# EAGLE design central (EAGLE 9.5.1)
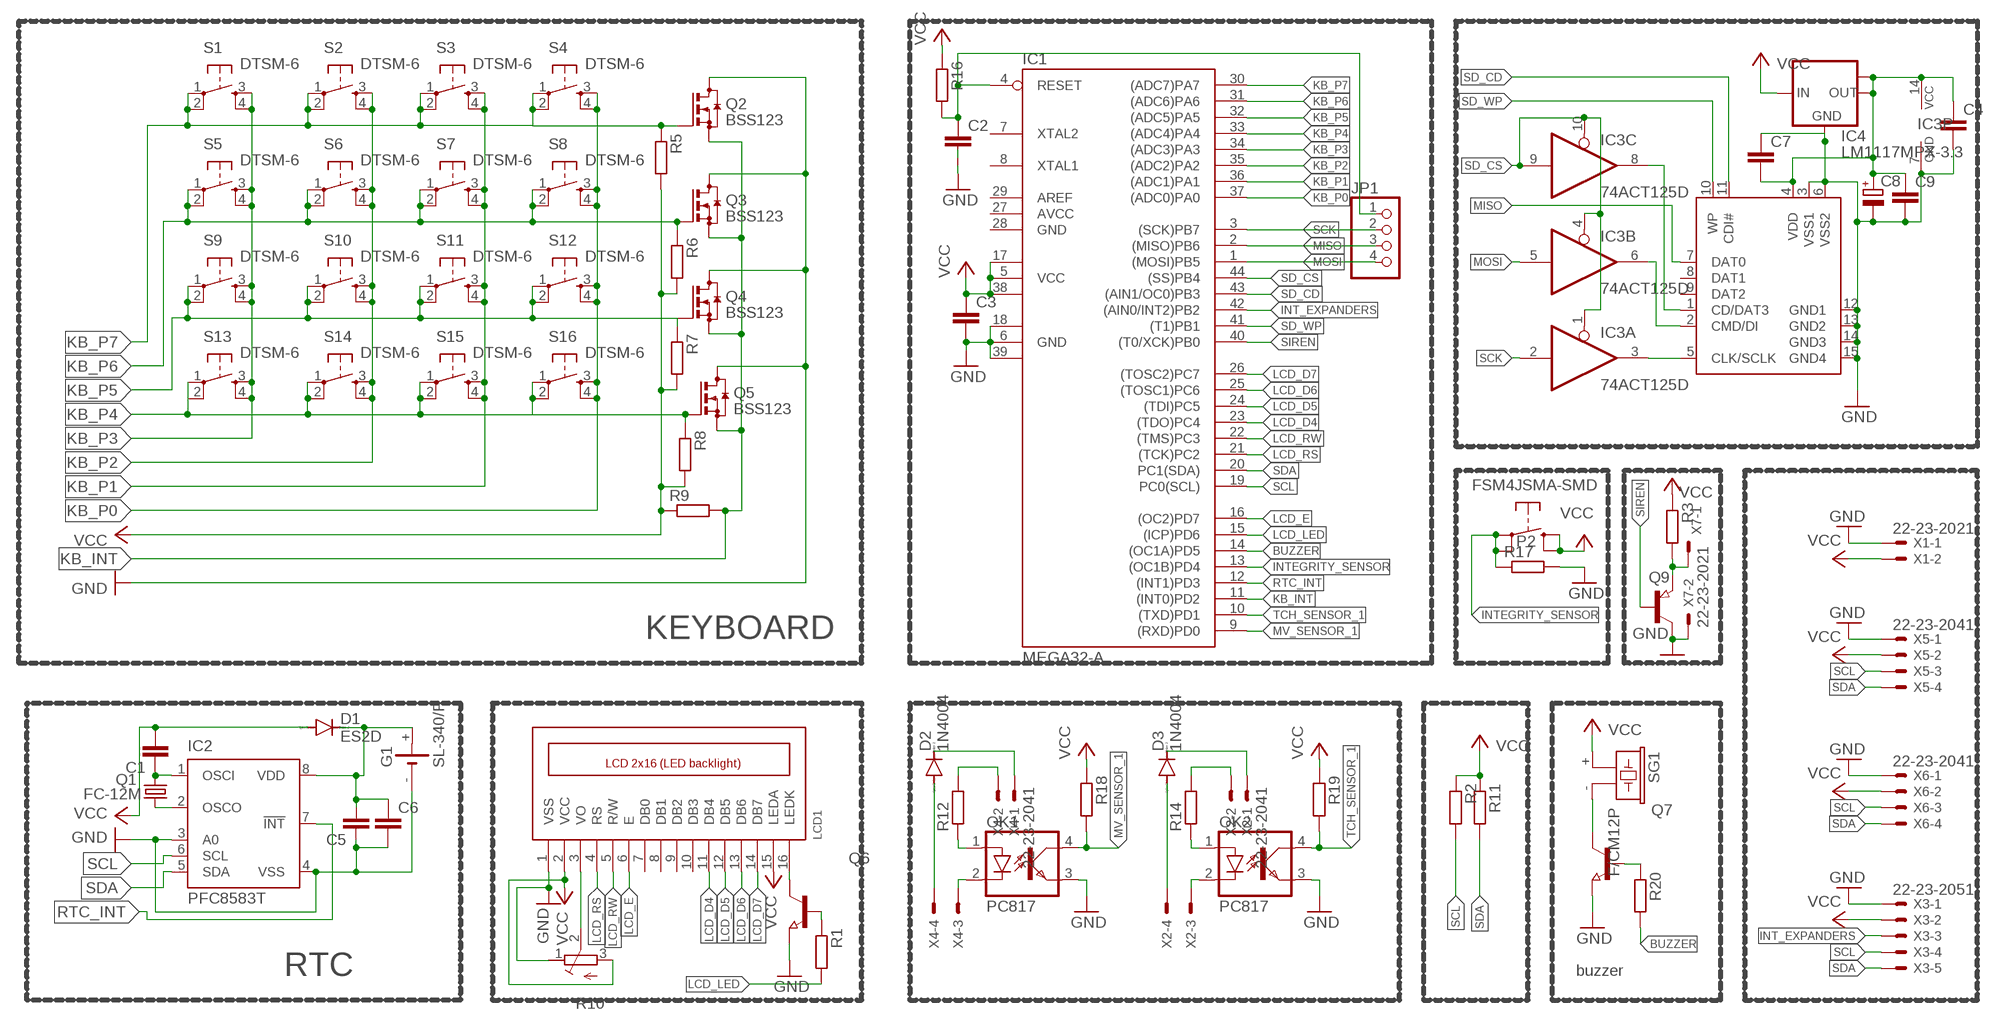
[diagram p0: schematic, sheet 1]

## Parts
C1  C-EUC2012  [C2012]
C2  C-EUC2012  [C2012]
C3  C-EUC2012  [C2012]
C4  C-EUC4532  [C4532]
C5  C-EUC2012  [C2012]
C6  C-EUC4532  [C4532]
C7  C-EUC4532  [C4532]
C8  CPOL-EUE1.8-4  [E1,8-4]
C9  C-EUC4532  [C4532]
D1  ES2D  [SMB]
D2  1N4004  [DO41-10]
D3  1N4004  [DO41-10]
G1  SL-340/P  [BEL/P]
IC1  MEGA32-A  [TQFP44]
IC2  PFC8583T  [SO8-7_5]
IC3  74ACT125D  [SO14]
IC4  LM1117MPX-3.3  [SOT223]
JP1  PINHD-1X4/90  [1X04/90]
LCD1  LCD_2X16_SIL  [HY-1602F]
OK1  PC817  [DIL04]
OK2  PC817  [DIL04]
P2  FSM4JSMA-SMD  [FSM4JSMA-SMD]
Q1  FC-12M  [FC-12M]
Q2  BSS123  [SOT23]
Q3  BSS123  [SOT23]
Q4  BSS123  [SOT23]
Q5  BSS123  [SOT23]
Q6  NPN-TRANSISTOR_SOT23  [SOT23]
Q7  NPN-TRANSISTOR_SOT23  [SOT23]
Q9  PNP-TRANSISTOR_SOT23  [SOT23]
R1  R-EU_M3216  [M3216]
R2  R-EU_M3216  [M3216]
R3  R-EU_M3216  [M3216]
R5  R-EU_M3216  [M3216]
R6  R-EU_M3216  [M3216]
R7  R-EU_M3216  [M3216]
R8  R-EU_M3216  [M3216]
R9  R-EU_M3216  [M3216]
R10  R-TRIMM3314G  [RTRIM3314G]
R11  R-EU_M3216  [M3216]
R12  R-EU_0309/12  [0309/12]
R14  R-EU_0309/12  [0309/12]
R16  R-EU_M3216  [M3216]
R17  R-EU_M3216  [M3216]
R18  R-EU_M3216  [M3216]
R19  R-EU_M3216  [M3216]
R20  R-EU_M3216  [M3216]
S1  DTSM-6  [DTSM-6]
S2  DTSM-6  [DTSM-6]
S3  DTSM-6  [DTSM-6]
S4  DTSM-6  [DTSM-6]
S5  DTSM-6  [DTSM-6]
S6  DTSM-6  [DTSM-6]
S7  DTSM-6  [DTSM-6]
S8  DTSM-6  [DTSM-6]
S9  DTSM-6  [DTSM-6]
S10  DTSM-6  [DTSM-6]
S11  DTSM-6  [DTSM-6]
S12  DTSM-6  [DTSM-6]
S13  DTSM-6  [DTSM-6]
S14  DTSM-6  [DTSM-6]
S15  DTSM-6  [DTSM-6]
S16  DTSM-6  [DTSM-6]
SG1  F/CM12P  [F/CM12P]
U$1  SDCARDVAR1  [SDCMF-10915W010]
X1  22-23-2021  [22-23-2021]
X2  22-23-2041  [22-23-2041]
X3  22-23-2051  [22-23-2051]
X4  22-23-2041  [22-23-2041]
X5  22-23-2041  [22-23-2041]
X6  22-23-2041  [22-23-2041]
X7  22-23-2021  [22-23-2021]

## Nets
BUZZER: IC1.14((OC1A)PD5) R20.2
GND [New Class]: C2.2 C3.2 C4.2 C5.1 C6.2 C7.1 C8.- C9.2 G1.- IC1.6(GND) IC1.18(GND1) IC1.39(GND2) IC2.3(A0) IC2.4(VSS) IC3.7(P:GND) IC4.1(GND) LCD1.1(VSS) OK1.3(EMIT) OK2.3(EMIT) Q2.3(D) Q3.3(D) Q4.3(D) Q5.3(D) Q6.2(E) Q7.2(E) Q9.3(C) R10.1(E) R17.2 U$1.3(VSS1) U$1.6(VSS2) U$1.12(GND1) U$1.13(GND2) U$1.14(GND3) U$1.15(GND4) X1.1 X3.1 X5.1 X6.1 X7.2
INT_EXPANDERS: IC1.42((AIN0/INT2)PB2) X3.3
INTEGRITY_SENSOR [New Class]: IC1.13((OC1B)PD4) P2.P$1(P) P2.P$2(P) R17.1
KB_INT [New Class]: IC1.11((INT0)PD2) Q2.2(S) Q3.2(S) Q4.2(S) Q5.2(S) R9.2
KB_P0 [New Class]: IC1.37((ADC0)PA0) S4.3 S4.4 S8.3 S8.4 S12.3 S12.4 S16.3 S16.4
KB_P1 [New Class]: IC1.36((ADC1)PA1) S3.3 S3.4 S7.3 S7.4 S11.3 S11.4 S15.3 S15.4
KB_P2 [New Class]: IC1.35((ADC2)PA2) S2.3 S2.4 S6.3 S6.4 S10.3 S10.4 S14.3 S14.4
KB_P3 [New Class]: IC1.34((ADC3)PA3) S1.3 S1.4 S5.3 S5.4 S9.3 S9.4 S13.3 S13.4
KB_P4 [New Class]: IC1.33((ADC4)PA4) Q5.1(G) R8.1 S13.1 S13.2 S14.1 S14.2 S15.1 S15.2 S16.1 S16.2
KB_P5 [New Class]: IC1.32((ADC5)PA5) Q4.1(G) R7.1 S9.1 S9.2 S10.1 S10.2 S11.1 S11.2 S12.1 S12.2
KB_P6 [New Class]: IC1.31((ADC6)PA6) Q3.1(G) R6.1 S5.1 S5.2 S6.1 S6.2 S7.1 S7.2 S8.1 S8.2
KB_P7 [New Class]: IC1.30((ADC7)PA7) Q2.1(G) R5.1 S1.1 S1.2 S2.1 S2.2 S3.1 S3.2 S4.1 S4.2
LCD_D4 [New Class]: IC1.23((TDO)PC4) LCD1.11(DB4)
LCD_D5 [New Class]: IC1.24((TDI)PC5) LCD1.12(DB5)
LCD_D6 [New Class]: IC1.25((TOSC1)PC6) LCD1.13(DB6)
LCD_D7 [New Class]: IC1.26((TOSC2)PC7) LCD1.14(DB7)
LCD_E [New Class]: IC1.16((OC2)PD7) LCD1.6(E)
LCD_LED [New Class]: IC1.15((ICP)PD6) R1.2
LCD_RS [New Class]: IC1.21((TCK)PC2) LCD1.4(RS)
LCD_RW [New Class]: IC1.22((TMS)PC3) LCD1.5(R/W)
MISO: IC1.2((MISO)PB6) JP1.3 U$1.7(DAT0)
MOSI: IC1.1((MOSI)PB5) IC3.5(B:I) JP1.4
MV_SENSOR_1: IC1.9((RXD)PD0) OK1.4(COL) R18.2
N$1: C1.1 IC2.1(OSCI) Q1.2
N$2: IC2.2(OSCO) Q1.1
N$3: D2.A X4.4
N$4: D3.A X2.4
N$5: C5.2 C6.1 D1.C G1.+ IC2.8(VDD)
N$6: LCD1.16(LEDK) Q6.3(C)
N$7: OK1.2(C) X4.3
N$8: R12.2 X4.2
N$9: D2.C X4.1
N$10: OK2.2(C) X2.3
N$11: R14.2 X2.2
N$12: D3.C X2.1
N$13: Q7.3(C) SG1.-
N$14: LCD1.3(VO) R10.2(S)
N$15: Q7.1(B) R20.1
N$16: C2.1 IC1.4(RESET) JP1.1 R16.2
N$17: Q6.1(B) R1.1
N$18: IC3.3(A:O) U$1.5(CLK/SCLK)
N$19: OK2.1(A) R14.1
N$20: IC3.6(B:O) U$1.2(CMD/DI)
N$21: OK1.1(A) R12.1
N$22: Q9.2(E) R3.2 X7.1
N$23: IC3.8(C:O) U$1.1(CD/DAT3)
N$28: C4.1 C7.2 C8.+ C9.1 IC3.14(P:VCC) IC4.2(OUT) IC4.TAB(OUT1) U$1.4(VDD)
RTC_INT [New Class]: IC1.12((INT1)PD3) IC2.7(!INT)
SCK: IC1.3((SCK)PB7) IC3.2(A:I) JP1.2
SCL [New Class]: IC1.19(PC0(SCL)) IC2.6(SCL) R2.2 X3.4 X5.3 X6.3
SD_CD: IC1.43((AIN1/OC0)PB3) U$1.11(CDI#)
SD_CS: IC1.44((SS)PB4) IC3.1(A:OE) IC3.4(B:OE) IC3.9(C:I) IC3.10(C:OE)
SD_WP: IC1.41((T1)PB1) U$1.10(WP)
SDA [New Class]: IC1.20(PC1(SDA)) IC2.5(SDA) R11.2 X3.5 X5.4 X6.4
SIREN [New Class]: IC1.40((T0/XCK)PB0) Q9.1(B)
TCH_SENSOR_1: IC1.10((TXD)PD1) OK2.4(COL) R19.2
VCC [New Class]: C1.2 C3.1 D1.A IC1.5(VCC) IC1.17(VCC1) IC1.38(VCC2) IC4.3(IN) LCD1.2(VCC) LCD1.15(LEDA) P2.P$3(S) P2.P$4(S) R2.1 R3.1 R5.2 R6.2 R7.2 R8.2 R9.1 R10.3(A) R11.1 R16.1 R18.1 R19.1 SG1.+ X1.2 X3.2 X5.2 X6.2
Unconnected: IC1.7(XTAL2) IC1.8(XTAL1) IC1.29(AREF) IC3.11(D:O) IC3.12(D:I) IC3.13(D:OE) LCD1.7(DB0) LCD1.8(DB1) LCD1.9(DB2) LCD1.10(DB3) U$1.8(DAT1) U$1.9(DAT2)

## Notes on the sheet
- KEYBOARD
- RTC | buzzer

## Power pins joined to a net without a drawn wire
AVCC: IC1.27(AVCC)
GND: IC1.28(GND)

## Library data of the parts
C1-C7 C9 = rcl:C-EU: CAPACITOR, European symbol; SPICEPREFIX: C
C8 = rcl:CPOL-EU: POLARIZED CAPACITOR, European symbol; SPICEPREFIX: C
D1 = diode:ES2D: DIODE super fast rectifier, 2 A
D2 D3 = diode:1N4004: DIODE general purpose rectifier, 1 A
G1 = battery:SL-340/P: LI BATTERY Sonnenschein SL-340
IC1 = atmel:MEGA32: MICROCONTROLLER 32 Kbytes FLASH 2 Kbytes SRAM 1 Kbytes EEPROM USART 8-channel 10 bit ADC Source: www.atmel.com .. doc2503.pdf; MPN: ATMEGA32-16AU; OC_FARNELL: 9171274; OC_NEWARK: 69K6677
IC2 = micro-philips:PFC8583: I2C-Bus CLOCK/CALENDAR; OC_FARNELL: unknown; OC_NEWARK: unknown
IC3 = 74xx-eu:74*125: Quad bus BUFFER, 3-state
IC4 = lm1117:LM1117MPX-*
JP1 = pinhead:PINHD-1X4: PIN HEADER
LCD1 = lcd_2x16_led_backlight:LCD_2X16_SIL
OK1 OK2 = optocoupler:PC817: SHARP OPTO COUPLER; MPN: PC817X4J000F; OC_FARNELL: 9707727; OC_NEWARK: 97K7059
P2 = switch-misc:FSM4JSMA-SMD: TYCO SWITCH
Q1 = crystal:FC-12M: kHz RANGE CRYSTAL UNIT LOW PROFILE SMD Source: Epson Toyocom FC-12M.pdf
Q2-Q5 = transistor-small-signal:BSS123: N-CHANNEL MOS FET
Q6 Q7 = semicon-smd-ipc:NPN-TRANSISTOR_: NPN TRANSISTOR
Q9 = semicon-smd-ipc:PNP-TRANSISTOR_: PNP TRANSISTOR
R1-R3 R5-R9 R11 R12 R14 R16-R20 = rcl:R-EU_: RESISTOR, European symbol; SPICEPREFIX: R
R10 = rcl:R-TRIMM: Trimm resistor; SPICEMODEL: X; SPICEPREFIXL: POT
S1-S16 = switch-tact:DTSM-6
SG1 = buzzer:F/CM12P: BUZZER Source: Buerklin; OC_FARNELL: unknown; OC_NEWARK: unknown
U$1 = kingfont_sdcmf10915w010:SDCARD: SD card connector KINGFONT SDCMF-10915W010
X1 X7 = con-molex:22-23-2021: .100" (2.54mm) Center Header - 2 Pin; MF: MOLEX; MPN: 22-23-2021; OC_FARNELL: 1462926; OC_NEWARK: 25C3832
X2 X4-X6 = con-molex:22-23-2041: .100" (2.54mm) Center Header - 4 Pin; MF: MOLEX; MPN: 22-23-2041; OC_FARNELL: 1462920; OC_NEWARK: 38C0355
X3 = con-molex:22-23-2051: .100" (2.54mm) Center Header - 5 Pin; MF: MOLEX; MPN: 22-23-2051; OC_FARNELL: 1462952; OC_NEWARK: 38C9178

## Board
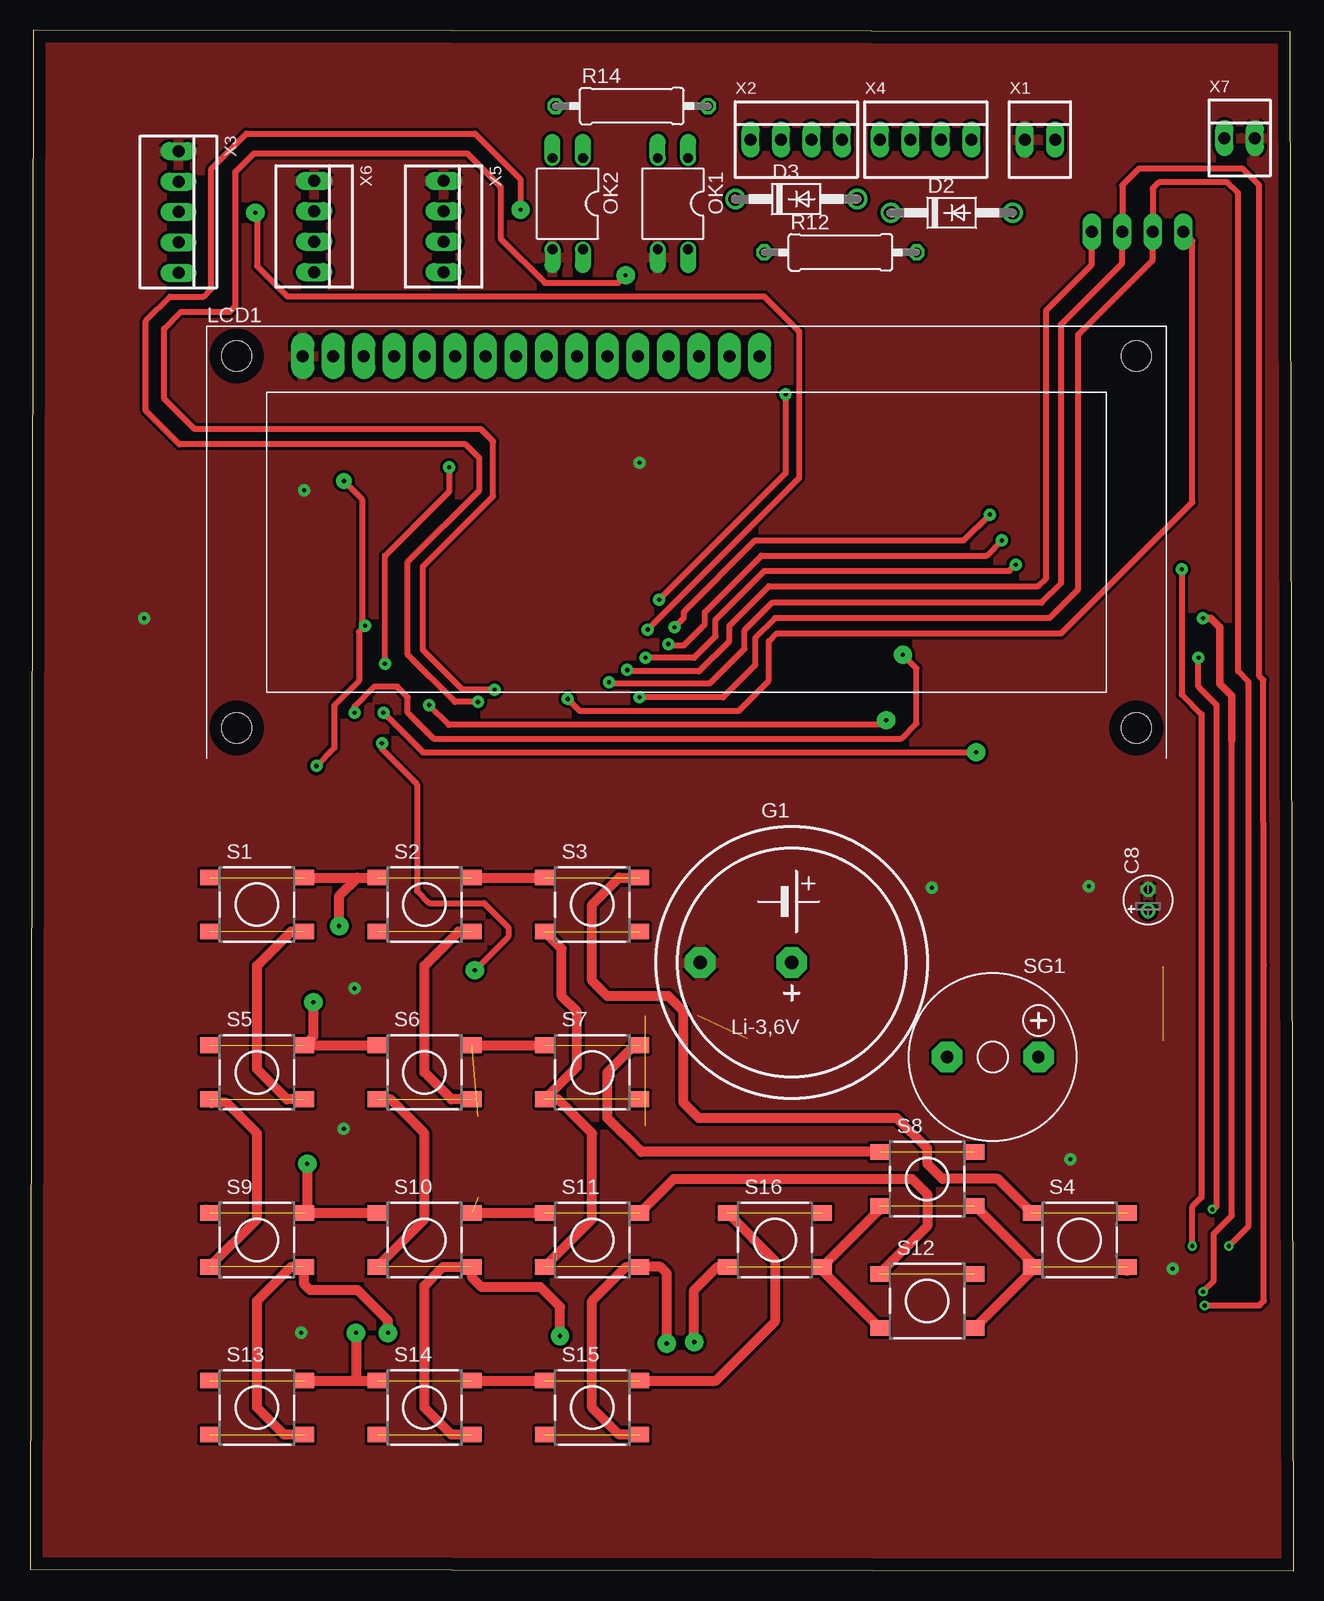
[diagram p1: board, top side]
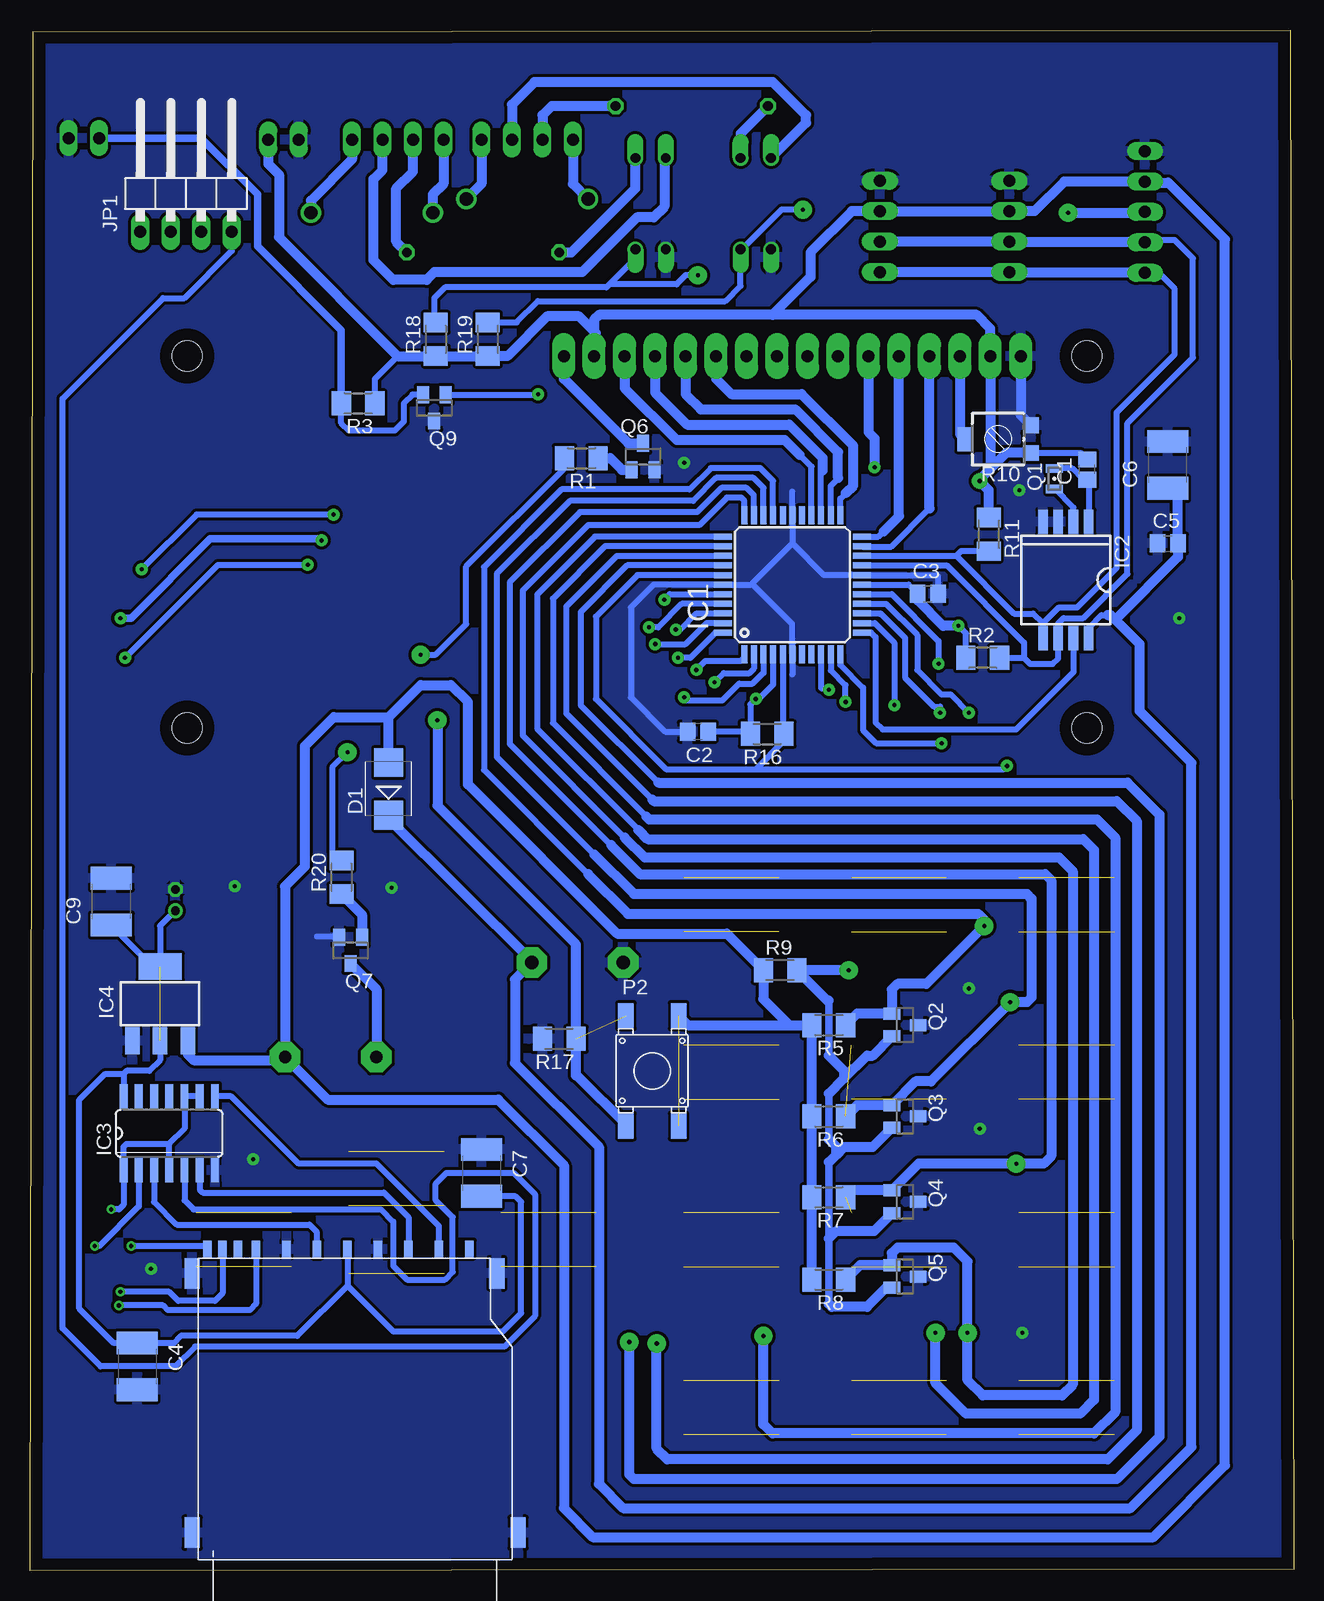
[diagram p2: board, bottom side, seen from below]

Size 105.33 x 128.39 mm. Coordinates in mm from the lower left corner, seen from the top.
Outline: 0,0.13 105.33,0 105.08,128.26 0.25,128.39 0,0.13
Copper layers (1*16): Top 0.035mm / dielectric 1.5mm / Bottom 0.035mm
Design rules "default": minimum track width 6mil, minimum drill 0.35mm, track to track 6mil, track to pad 6mil, pad to pad 6mil, via to via 6mil, smd to smd 6mil, copper to edge 40mil, drill to drill 6mil, minimum pad ring 10mil, minimum via ring 8mil, stop-mask expansion 4mil, vias tented up to drill 0mil, thermal gap 10mil

### Footprints (pad centres in the part's own frame; a part is rotated, then mirrored left to right if it is on the bottom)
C2012 = smd 1.3 x 1.5: 1 -0.85,0; 2 0.85,0
C4532 = smd 1.9 x 3.4: 1 -1.95,0; 2 1.95,0
E1,8-4 = drill 0.711 pad 1.168: + -0.889,0 | drill 0.711 pad 1.168 octagon: - 0.889,0
SMB = smd 2.4 x 2.4: A 2.2,0; C -2.2,0
DO41-10 = drill 1.118: A 5.08,0; C -5.08,0
BEL/P = drill 1.118 pad 2.54 octagon: + 0,0; - -7.62,0
TQFP44 = smd 1.5 x 0.5: 1 -5.8,4; 2 -5.8,3.2; 3 -5.8,2.4; 4 -5.8,1.6; 5 -5.8,0.8; 6 -5.8,0; 7 -5.8,-0.8; 8 -5.8,-1.6; 9 -5.8,-2.4; 10 -5.8,-3.2; 11 -5.8,-4; 23 5.8,-4; 24 5.8,-3.2; 25 5.8,-2.4; 26 5.8,-1.6; 27 5.8,-0.8; 28 5.8,0; 29 5.8,0.8; 30 5.8,1.6; 31 5.8,2.4; 32 5.8,3.2; 33 5.8,4 | smd 0.5 x 1.5: 12 -4,-5.8; 13 -3.2,-5.8; 14 -2.4,-5.8; 15 -1.6,-5.8; 16 -0.8,-5.8; 17 0,-5.8; 18 0.8,-5.8; 19 1.6,-5.8; 20 2.4,-5.8; 21 3.2,-5.8; 22 4,-5.8; 34 4,5.8; 35 3.2,5.8; 36 2.4,5.8; 37 1.6,5.8; 38 0.8,5.8; 39 0,5.8; 40 -0.8,5.8; 41 -1.6,5.8; 42 -2.4,5.8; 43 -3.2,5.8; 44 -4,5.8
SO8-7_5 = smd 0.8 x 2: 1 -1.905,-4.845; 2 -0.635,-4.845; 3 0.635,-4.845; 4 1.905,-4.845; 5 1.905,4.845; 6 0.635,4.845; 7 -0.635,4.845; 8 -1.905,4.845
SO14 = smd 0.66 x 2.032: 1 -3.81,-3.073; 2 -2.54,-3.073; 3 -1.27,-3.073; 4 0,-3.073; 5 1.27,-3.073; 6 2.54,-3.073; 7 3.81,-3.073; 8 3.81,3.073; 9 2.54,3.073; 10 1.27,3.073; 11 0,3.073; 12 -1.27,3.073; 13 -2.54,3.073; 14 -3.81,3.073
SOT223 = smd 1.219 x 2.235: 1 -2.311,-3.099; 2 0,-3.099; 3 2.311,-3.099 | smd 3.6 x 2.2: TAB 0,3.099
1X04/90 = drill 1.016 long: 1 -3.81,-3.81; 2 -1.27,-3.81; 3 1.27,-3.81; 4 3.81,-3.81
HY-1602F = drill 1 pad 1.93 long: 1 2.54,0; 2 5.08,0; 3 7.62,0; 4 10.16,0; 5 12.7,0; 6 15.24,0; 7 17.78,0; 8 20.32,0; 9 22.86,0; 10 25.4,0; 11 27.94,0; 12 30.48,0; 13 33.02,0; 14 35.56,0; 15 38.1,0; 16 40.64,0 | hole 2.5: -2.96,0; 72.04,0; -2.96,-31; 72.04,-31
DIL04 = drill 0.813 offset: 1 -1.27,-3.81; 2 1.27,-3.81; 3 1.27,3.81; 4 -1.27,3.81
FSM4JSMA-SMD = smd 1.3 x 2.1: P$1 -2.196,4.584; P$2 -2.196,-4.6; P$3 2.204,4.584; P$4 2.204,-4.6
FC-12M = smd 0.7 x 1.4: 1 -0.85,0; 2 0.85,0
SOT23 = smd 1 x 1.4: 1 -0.95,-1.1; 2 0.95,-1.1; 3 0,1.1
M3216 = smd 1.6 x 2: 1 -1.4,0; 2 1.4,0
RTRIM3314G = smd 1.3 x 1.3: 1 1.15,-2.75; 3 -1.15,-2.75 | smd 2 x 1.3: 2 0,2.75
0309/12 = drill 0.813 octagon: 1 -6.35,0; 2 6.35,0
DTSM-6 = smd 1.55 x 1.3: 1 -3.975,2.25; 2 3.975,2.25; 3 -3.975,-2.25; 4 3.975,-2.25
F/CM12P = drill 1.016 pad 2.54 octagon: + 3.81,0; - -3.81,0
SDCMF-10915W010 = smd 0.711 x 1.422: 1 7.366,13.462; 2 4.826,13.462; 3 2.286,13.462; 4 -0.254,13.462; 5 -2.794,13.462; 6 -5.334,13.462; 7 -7.874,13.462; 8 -9.398,13.462; 9 9.906,13.462; 10 -11.938,13.462; 11 -10.668,13.462 | smd 1.27 x 2.54: 12 12.192,11.43; 13 13.97,-10.16; 14 -13.208,-10.16; 15 -13.208,11.43
22-23-2021 = drill 1 long: 1 -1.27,0; 2 1.27,0
22-23-2041 = drill 1 long: 1 -3.81,0; 2 -1.27,0; 3 1.27,0; 4 3.81,0
22-23-2051 = drill 1 long: 1 -5.08,0; 2 -2.54,0; 3 0,0; 4 2.54,0; 5 5.08,0

### Placement (x,y rotation side)
C1  17.21,91.76 90 bottom
C2  49.66,69.91 180 bottom
C3  30.48,81.41 0 bottom
C4  96.39,17.02 270 bottom
C5  10.48,85.6 0 bottom
C6  10.48,92.14 90 bottom
C7  67.69,33.15 270 bottom
C8  93.22,55.88 90 top
C9  98.55,55.75 90 bottom
D1  75.44,65.15 90 bottom
D2  76.84,113.16 0 top
D3  63.88,114.3 0 top
G1  63.5,50.67 0 top
IC1  41.78,82.17 90 bottom
IC2  18.99,82.55 180 bottom
IC3  93.73,36.45 0 bottom
IC4  94.49,47.24 0 bottom
JP1  92.33,115.38 0 bottom
LCD1  20.19,101.22 0 top
OK1  53.59,113.92 180 top
OK2  44.83,113.92 180 top
P2  53.47,41.66 0 bottom
Q1  19.94,91 90 bottom
Q2  32.38,45.47 270 bottom
Q3  32.38,37.85 270 bottom
Q4  32.38,30.73 270 bottom
Q5  32.38,24.51 270 bottom
Q6  54.23,92.84 0 bottom
Q7  78.61,51.69 180 bottom
Q9  71.63,96.9 180 bottom
R1  59.37,92.71 180 bottom
R2  25.91,76.07 0 bottom
R3  77.98,97.28 180 bottom
R5  38.73,45.47 180 bottom
R6  38.73,37.85 180 bottom
R7  38.73,31.11 180 bottom
R8  38.73,24.26 180 bottom
R9  42.8,50.04 0 bottom
R10  24.64,94.3 90 bottom
R11  25.4,86.36 270 bottom
R12  67.56,109.86 0 top
R14  50.17,122.05 0 top
R16  43.88,69.72 180 bottom
R17  61.21,44.32 180 bottom
R18  71.5,102.62 90 bottom
R19  67.18,102.62 90 bottom
R20  79.38,57.78 90 bottom
S1  18.92,55.5 0 top
S2  32.89,55.5 0 top
S3  46.86,55.5 0 top
S4  87.5,27.56 0 top
S5  18.92,41.53 0 top
S6  32.89,41.53 0 top
S7  46.86,41.53 0 top
S8  74.8,32.64 0 top
S9  18.92,27.56 0 top
S10  32.89,27.56 0 top
S11  46.86,27.56 0 top
S12  74.8,22.48 0 top
S13  18.92,13.59 0 top
S14  32.89,13.59 0 top
S15  46.86,13.59 0 top
S16  62.1,27.56 0 top
SG1  80.26,42.8 0 top
U$1  78.61,13.34 0 bottom
X1  84.2,119.25 0 top
X2  63.88,119.25 0 top
X3  12.38,113.22 270 top
X4  74.68,119.25 0 top
X5  34.48,112.01 270 top
X6  23.69,112.01 270 top
X7  100.84,119.38 0 top

### Tracks (layer width: path | path; a pad name or v marks a point on that pad's centre or on a via)
BUZZER  (via drill 0.35 pad 1, 0.35 pad 1.52)
  Top 0.508: v29.46,71.5 32.77,68.2 v78.87,68.2
  Bottom 0.508: IC1.14 34.56,79.77 34.54,79.76 34.42,79.76 32.38,77.72 32.38,74.42 29.97,72.01 29.46,72.01 v29.46,71.5 | v78.87,68.2 80.14,66.93 80.14,59.95 R20.2
GND  (via drill 0.35 pad 1)
  Bottom 0.508: 41.78,85.6 IC1.28 41.78,89.92 | 41.78,85.6 45.15,82.23 | 41.78,85.6 39.15,82.97 IC1.18 29.76,82.97 29.63,82.84 C3.2 | 45.15,82.23 41.78,78.87 IC1.6 41.78,74.68 | Q7.2 79.61,52.83 81.41,52.83 | 45.15,82.23 45.21,82.17 IC1.39 53.34,82.17 55.25,80.26 55.25,72.77 52.39,69.91 C2.2
  Bottom 0.813: LCD1.1 22.73,96.29 R10.1
  other vias: 95.25,25.15 88.27,57.02 75.18,56.9 86.74,34.29 50.8,92.33 9.53,79.38 22.86,90.04 22.61,19.81 26.16,36.83 27.05,48.51
  pour Bottom (isolate 0.254): -6.1,131.32 111.76,131.32 111.76,104.52 111.76,-7.62 71.25,-7.62 -6.1,-7.62
  pour Top (isolate 0.254): -5.59,132.08 115.44,132.08 115.44,-7.62 -5.59,-7.62
INT_EXPANDERS  (via drill 0.35 pad 1, 0.35 pad 1.52)
  Top 0.508: v51.5,78.42 64.14,91.06 64.14,103.25 61.21,106.17 21.46,106.17 18.92,108.71 18.92,112.78 18.8,112.9 v18.8,113.16
  Bottom 0.508: v51.5,78.42 51.12,78.42 49.77,79.77 IC1.42
  Bottom 0.813: v18.8,113.16 12.45,113.16 X3.3
INTEGRITY_SENSOR  (via drill 0.35 pad 1, 0.35 pad 1.52)  (1 unrouted)
  Top 0.508: v33.27,72.14 34.93,70.48 70.99,70.48 v71.37,70.87
  Bottom 0.508: IC1.13 34.9,78.97 33.27,77.34 v33.27,72.14
  Bottom 0.813: P2.P$2 55.66,37.18 59.69,41.21 59.81,41.25 R17.1 59.81,52.19 71.37,63.75 v71.37,70.87
KB_INT  (via drill 0.35 pad 1, 0.35 pad 1.52)
  Top 0.508: v37.08,50.04 39.88,52.83 39.88,53.59 37.85,55.63 33.27,55.63 32.26,56.64 32.26,65.53 29.34,68.45 v29.34,68.96
  Bottom 0.508: IC1.11 37.78,75.48 35.88,73.58 35.88,70.04 34.8,68.96 v29.34,68.96
  Bottom 0.61: 38.73,47.5 38.73,42.93 | 38.73,34.04 38.73,27.69 38.73,22.22 | 38.73,35.94 38.73,39.75
  Bottom 0.813: Q3.2 35.08,35.31 37.47,35.31 38.1,34.67 | Q2.2 35.08,42.93 35.56,42.93 37.47,41.02 | Q4.2 34.95,28.32 38.1,28.32 38.73,27.69 | Q5.2 33.97,23.56 35.56,21.97 38.48,21.97 38.73,22.22 | 38.73,34.04 38.1,34.67 | 38.1,34.67 38.1,35.31 38.73,35.94 | 38.73,39.75 37.47,41.02 | 37.47,41.02 37.47,41.66 38.73,42.93 | 38.73,47.5 38.86,47.5 R9.2 v37.08,50.04
KB_P0  (via drill 0.35 pad 1.52)  (3 unrouted)
  Top 0.813: S4.4 91.48,24.98 | S12.3 66.08,24.98 S16.4 70.83,30.06 S8.3 | S12.4 83.53,24.98 S4.3 83.53,25.64 S8.4 | v55.37,19.05 55.37,23.37 57.31,25.31 S16.3
  Bottom 0.508: IC1.37 55.55,83.77 59.44,79.88 59.44,72.14 52.96,65.66
  Bottom 0.813: 52.96,65.66 13.84,65.66 11.18,62.99 11.18,11.18 14.73,7.62 54.99,7.62 55.37,8 v55.37,19.05
KB_P1  (via drill 0.35 pad 1.52)  (4 unrouted)
  Top 0.813: S15.4 49.11,11.34 46.86,13.59 46.86,22.48 49.69,25.31 S11.4 52.54,25.31 53.09,24.76 v53.09,18.92 | S11.3 46.86,29.28 46.86,36.45 44.03,39.28 S7.3 45.59,41.98 45.59,46.61 44.32,47.88 44.32,51.81 S3.3
  Bottom 0.508: IC1.36 56.4,84.57 60.64,80.33 60.64,71.44 53.47,64.26
  Bottom 0.813: 53.47,64.26 53.34,64.13 14.73,64.13 13.08,62.48 13.08,11.68 15.49,9.27 52.2,9.27 53.09,10.16 v53.09,18.92
KB_P2  (via drill 0.35 pad 1.52)  (4 unrouted)
  Top 0.813: S14.4 35.14,11.34 32.89,13.59 32.89,23.75 34.45,25.31 S10.4 36.87,24.42 37.67,23.62 42.55,23.62 44.2,21.97 v44.2,19.56 | S10.3 32.89,29.28 32.89,36.45 30.06,39.28 S6.3 | S6.4 35.14,39.28 32.89,41.53 32.89,50.42 35.72,53.25 S2.4
  Bottom 0.508: IC1.35 57.38,85.37 61.75,81 61.75,70.64 53.98,62.86
  Bottom 0.813: 53.98,62.86 53.72,62.61 16.38,62.61 14.86,61.09 14.86,13.21 16.64,11.43 43.43,11.43 44.2,12.19 v44.2,19.56
KB_P3  (via drill 0.35 pad 1.52)  (4 unrouted)
  Top 0.813: S13.4 21.17,11.34 18.92,13.59 18.92,22.48 21.75,25.31 S9.4 22.86,25.27 22.86,23.88 23.37,23.37 27.3,23.37 29.84,20.83 v29.84,19.81 | S9.3 18.92,29.28 18.92,36.45 16.38,38.99 15.11,38.99 14.95,39.15 S5.3 | S5.4 21.43,39.28 18.92,41.78 18.92,50.42 21.75,53.25 S1.4
  Bottom 0.508: IC1.34 58.23,86.17 63.05,81.34 63.05,70.17 54.61,61.72
  Bottom 0.813: 54.61,61.72 53.85,60.96 17.53,60.96 16.64,60.07 16.64,14.22 17.78,13.08 27.3,13.08 29.84,15.62 v29.84,19.81
KB_P4  (via drill 0.35 pad 1.52)  (4 unrouted)
  Top 0.813: S13.2 27.18,15.84 | 27.18,15.84 S14.1 | S14.2 S15.1 | S15.2 57.19,15.84 62.1,20.75 62.1,25.83 S16.1 | v27.18,19.81 27.18,15.84
  Bottom 0.508: IC1.33 45.78,89.15 46.04,89.41 47.24,89.41 49.53,87.12 58.8,87.12 64.26,81.66 64.26,69.6 55.75,61.09
  Bottom 0.813: R8.1 36.13,25.46 Q5.1 33.48,26.46 33.02,26.92 28.32,26.92 27.18,25.78 v27.18,19.81 27.18,15.88 25.91,14.61 19.3,14.61 18.41,15.49 18.41,58.29 19.56,59.44 54.1,59.44 55.75,61.09
KB_P5  (via drill 0.35 pad 1.52)  (4 unrouted)
  Top 0.813: S10.1 S9.2 23.11,30.03 v23.11,33.91 | S10.2 S11.1 | S9.1 14.66,30.1 | S11.2 53.67,32.64 73.53,32.64 74.8,31.37 74.8,28.7 S12.1
  Bottom 0.508: IC1.32 44.98,89.62 45.59,90.23 47.69,90.23 49.72,88.2 59.5,88.2 65.34,82.36 65.34,68.9 56.9,60.45
  Bottom 0.813: R7.1 36.77,31.68 Q4.1 31.26,33.91 v23.11,33.91 20.83,33.91 20.19,34.54 20.19,57.53 20.7,58.04 54.48,58.04 56.9,60.45
KB_P6  (via drill 0.35 pad 1.52)  (4 unrouted)
  Top 0.813: S6.1 S5.2 23.62,44.5 v23.62,47.37 | S6.2 S7.1 | S8.1 50.96,34.89 48.13,37.72 48.13,41.53 50.38,43.78 S7.2
  Bottom 0.508: IC1.31 44.18,90.22 45.02,91.06 48.13,91.06 50.04,89.15 60.33,89.15 66.42,83.06 66.42,67.82 58.29,59.69
  Bottom 0.813: R6.1 36.38,38.8 Q3.1 31.51,40.77 30.23,40.77 v23.62,47.37 22.22,47.37 21.84,47.75 21.84,56.01 22.22,56.39 54.99,56.39 58.29,59.69
KB_P7  (via drill 0.35 pad 1.52)  (4 unrouted)
  Top 0.813: S1.2 27.3,57.75 | 27.3,57.75 S2.1 | S2.2 S3.1 | S4.1 80.7,32.64 76.07,32.64 74.8,33.91 74.8,35.18 72.26,37.72 55.75,37.72 54.48,38.99 54.48,46.61 53.21,47.88 48.13,47.88 46.86,49.15 46.86,55.5 49.11,57.75 S3.2 | v25.78,53.72 25.78,56.22 27.3,57.75
  Bottom 0.508: IC1.30 43.38,90.82 44.45,91.88 48.58,91.88 50.36,90.11 61.02,90.11 67.5,83.63 67.5,66.74 58.8,58.04
  Bottom 0.813: R5.1 36.38,46.42 Q2.1 33.48,48.43 33.02,48.89 30.61,48.89 v25.78,53.72 25.78,54.23 26.29,54.74 55.5,54.74 58.8,58.04
LCD_D4
  Bottom 0.508: IC1.23 37.78,89.34 37.34,89.79
  Bottom 0.813: LCD1.11 48.13,99.31 46.86,98.04 41.02,98.04 36.7,93.73 36.7,90.42 37.34,89.79
LCD_D5
  Bottom 0.508: IC1.24 38.58,90.4 37.97,91.01 37.97,91.06
  Bottom 0.813: LCD1.12 50.67,98.04 49.4,96.77 41.53,96.77 37.97,93.22 37.97,91.06
LCD_D6
  Bottom 0.508: 39.24,91.69 39.38,91.55 IC1.25
  Bottom 0.813: LCD1.13 53.21,98.17 50.55,95.5 42.04,95.5 39.24,92.71 39.24,91.69
LCD_D7
  Bottom 0.508: IC1.26 40.18,92 41.15,92.96
  Bottom 0.813: LCD1.14 55.75,98.55 51.44,94.23 42.42,94.23 41.15,92.96
LCD_E  (via drill 0.35 pad 1)
  Top 0.508: v29.59,75.56 29.59,84.58 34.93,89.92 v34.93,91.95
  Bottom 0.508: IC1.16 33.49,81.37 29.59,77.47 v29.59,75.56
  Bottom 0.813: v34.93,91.95 34.93,94.36 35.43,94.87 LCD1.6
LCD_LED  (via drill 0.35 pad 1, 0.35 pad 1.52)
  Top 0.508: v27.05,71.5 27.05,72.01 28.7,73.66 30.61,73.66 31.5,72.77 31.5,71.5 33.66,69.34 72.64,69.34 73.91,70.61 73.91,75.18 v72.77,76.33
  Bottom 0.508: IC1.15 33.96,80.57 31.37,77.98 31.37,75.06 29.34,73.02 28.57,73.02 v27.05,71.5 | v72.77,76.33 71.5,76.33 68.96,78.87 68.96,83.69 60.77,91.88 R1.2
LCD_RS
  Bottom 0.508: IC1.21 35.96,85.34 33.53,85.34 30.35,88.52
  Bottom 0.813: 30.35,88.52 LCD1.4
LCD_RW
  Bottom 0.508: IC1.22 34.61,86.17 34.16,86.61
  Bottom 0.813: 34.16,86.61 32.89,87.88 LCD1.5
MISO  (via drill 0.35, 0.35 pad 1)
  Top 0.508: v48.26,74.04 48.39,73.91 56.64,73.91 59.56,76.83 59.56,78.36 61.85,80.64 84.33,80.64 85.98,82.3 85.98,103.89 91.06,108.97 JP1.3 91.06,115.44 92.46,116.84 101.09,116.84 102.45,115.49 102.45,74.59 102.83,74.21 102.85,50.48 102.87,50.46 102.87,22.48 102.49,22.1 v97.92,22.1
  Bottom 0.508: IC1.2 44.98,75.16 45.34,74.8 47.5,74.8 v48.26,74.04 | U$1.7 86.49,22.22 87,21.72 93.85,21.72 94.23,22.1 v97.92,22.1
MOSI  (via drill 0.35 pad 1)
  Top 0.508: v49.78,75.06 49.91,74.93 55.75,74.93 58.29,77.47 58.29,78.74 61.6,82.04 84.07,82.04 84.71,82.68 84.71,105.03 88.52,108.84 JP1.4
  Bottom 0.508: IC1.1 45.78,76.11 46.08,75.82 49.02,75.82 v49.78,75.06 | IC3.5 92.46,30.86 91.69,30.1 76.07,30.1 75.06,29.08 75.06,25.4 73.91,24.26 70.74,24.26 70.1,24.89 70.1,29.46 71.5,30.86 71.5,32.26 70.61,33.15 65.02,33.15 63.25,31.37 63.25,21.21 65.79,18.67 91.57,18.67 93.22,17.02 99.44,17.02 102.62,20.19 102.62,97.66 94.23,106.05 92.46,106.05 88.52,109.98 JP1.4
MV_SENSOR_1  (via drill 0.35 pad 1, 0.35 pad 1.52)
  Top 0.508: v38.73,73.41 36.07,73.41 32.77,76.71 32.77,83.69 38.61,89.53 38.61,94.11 37.59,95.12 13.72,95.12 11.18,97.66 11.18,103.5 12.57,104.9 16.64,104.9 17.14,105.41 17.14,116.59 18.67,118.11 36.45,118.11 39.24,115.32 39.24,111 42.93,107.31 49.02,107.31 v49.66,107.95
  Bottom 0.508: OK1.4 54.86,109.35 57.02,107.19 | 57.02,107.19 57.28,106.93 70.74,106.93 71.63,106.05 71.63,104.14 R18.2 | IC1.9 39.38,73.55 39.37,73.53 38.86,73.53 v38.73,73.41 | v49.66,107.95 50.67,107.95 51.44,107.19 57.02,107.19
N$1
  Bottom 0.508: IC2.1 17.08,90.78 C1.1 17.5,90.91 18.44,91.85 Q1.2
N$2
  Bottom 0.508: IC2.2 18.35,88.58 19.91,90.15 Q1.1
N$3
  Bottom 0.813: X4.4 78.49,117.6 81.92,114.17 D2.A
N$4
  Bottom 0.813: X2.4 67.69,115.57 D3.A
N$5
  Bottom 0.508: 15.49,79.63 16,79.63 17.08,78.55 IC2.8 | 9.75,85.72 C5.2
  Bottom 0.813: 14.86,79.25 9.63,84.48 C5.2 9.63,90.19 C6.1 | D1.C 75.44,62.68 63.5,50.8 G1.+ 64.9,49.28 64.9,42.29 57.91,35.31 57.91,7.24 55.88,5.21 13.59,5.21 8.51,10.29 8.51,67.31 12.83,71.63 12.83,77.22 14.86,79.25 | 15.49,79.63 15.24,79.63 14.86,79.25
N$6
  Bottom 0.813: LCD1.16 60.83,99.31 55.46,93.94 Q6.3
N$7
  Bottom 0.813: OK1.2 52.45,117.6 52.45,113.66 53.34,112.78 54.74,112.78 59.31,108.2 71.63,108.2 72.26,107.57 75.06,107.57 76.71,109.22 76.71,115.95 75.95,116.71 X4.3
N$8
  Bottom 0.813: R12.2 74.8,110.74 74.8,115.19 73.41,116.59 X4.2
N$9
  Bottom 0.813: X4.1 70.87,115.57 71.76,114.68 D2.C
N$10
  Bottom 0.813: OK2.2 40.64,120.65 40.64,121.29 43.4,124.04 63.28,124.04 65.15,122.17 X2.3
N$11
  Bottom 0.813: R14.2 61.85,122.05 62.61,121.29 X2.2
N$12
  Bottom 0.813: X2.1 60.07,115.57 D3.C
N$13
  Bottom 0.813: Q7.3 76.45,48.43 SG1.-
N$14
  Bottom 0.813: LCD1.3 27.81,94.72 R10.2
N$15
  Bottom 0.813: R20.1 77.66,54.67 Q7.1
N$16  (via drill 0.35 pad 1)
  Top 0.508: v44.83,72.64 45.85,71.63 59.05,71.63 61.6,74.17 61.6,77.47 62.23,78.11 85.98,78.11 96.9,89.03 96.9,110.81 JP1.1
  Bottom 0.508: IC1.4 43.38,73.84 44.58,72.64 v44.83,72.64 45.28,72.2 R16.2 45.47,69.91 C2.1
N$17
  Bottom 0.813: Q6.1 55.98,91.74 56.96,92.71 R1.1
N$18
  Bottom 0.508: U$1.5 81.41,28.19 82.04,28.83 93.09,28.83 95,30.73 IC3.3
N$19
  Bottom 0.813: R14.1 46.1,119.76 OK2.1
N$20
  Bottom 0.508: U$1.2 73.79,29.46 75.82,31.5 90.93,31.5 91.19,31.75 IC3.6
N$21
  Bottom 0.813: R12.1 60.2,109.86 54.86,115.19 OK1.1
N$22
  Bottom 0.508: Q9.2 73.45,98 74.17,97.28 74.17,95.76 74.93,95 78.74,95 79.38,95.63 R3.2
  Bottom 0.61: R3.2 79.38,103.38 86.36,110.36 86.36,114.68 91.06,119.38 X7.1
N$23
  Bottom 0.508: U$1.1 71.25,28.7 76.45,33.91 82.93,33.91 88.54,39.52 IC3.8
N$28  (1 unrouted)
  Bottom 0.508: U$1.4 78.87,23.75 | C7.2 64.85,31.2 64.39,30.73 64.39,21.46 65.91,19.94 75.06,19.94 78.87,23.75 | 78.87,23.75 83.06,19.56 92.76,19.56 93.34,18.97 C4.1 98.34,18.97 101.22,21.84 101.22,39.24 99.06,41.4 97.54,41.4 | IC4.2 94.49,42.55 95.38,41.66 97.28,41.66 97.54,41.4 | 97.54,41.4 IC3.14 | C9.1 95.09,50.34 IC4.TAB 94.49,53.72 C8.+
RTC_INT
  Bottom 0.508: IC2.7 18.35,74.87 23.11,70.1 34.27,70.1 34.84,70.68 34.84,77.79 35.22,78.17 IC1.12
SCK  (via drill 0.35, 0.35 pad 1)
  Top 0.508: v50.8,72.77 57.79,72.77 60.45,75.44 60.45,77.72 62.1,79.38 84.96,79.38 87.38,81.79 87.38,103 93.6,109.22 JP1.2 93.6,115.19 94.11,115.7 99.82,115.7 100.71,114.81 100.71,74.93 101.6,74.04 101.6,28.7 v99.95,27.05
  Bottom 0.508: IC1.3 44.18,74.82 45.09,73.91 46.23,73.91 47.62,72.52 50.8,72.52 v50.8,72.77 | IC3.2 96.27,30.35 99.57,27.05 v99.95,27.05
SCL
  Bottom 0.508: IC1.19 28.91,83.77 22.48,77.34 22.48,76.07 | 22.48,76.07 21.97,75.56 20.07,75.56 19.62,76.01 IC2.6 19.62,78.93 19.18,79.38 17.53,79.38 13.84,83.06 13.84,95.63 8.38,101.09 8.38,109.35 9.91,110.87 12.19,110.87 X3.4 11.56,110.68 | R2.2 22.48,76.07
  Bottom 0.813: X3.4 23.62,110.68 X6.3 X5.3
SD_CD  (via drill 0.35, 0.35 pad 1)
  Top 0.508: 100.2,69.22 100.2,29.59 98.68,28.07 98.68,24.13 v97.79,23.24 | v53.21,77.22 53.34,77.09 54.48,77.09 56.26,78.87 56.26,79.88 60.96,84.58 79.76,84.58 v81.03,85.85
  Top 0.61: 100.2,69.22 100.2,72.9 99.19,73.91 99.19,78.61 98.42,79.38 v97.79,79.38
  Bottom 0.508: U$1.11 89.28,23.11 89.92,22.48 92.96,22.48 93.73,23.24 v97.79,23.24 | IC1.43 48.92,78.97 50.67,77.22 v53.21,77.22
  Bottom 0.61: v97.79,79.38 96.9,79.38 90.3,85.98 81.03,85.98 v81.03,85.85
SD_CS  (via drill 0.35, 0.35 pad 1)
  Top 0.508: v98.55,30.1 98.68,30.1 98.93,30.35 98.93,72.14 97.41,73.66 v97.41,76.07 | v51.31,76.07 55.37,76.07 57.15,77.85 57.15,79.25 61.21,83.31 81.66,83.31 v82.17,83.82
  Bottom 0.508: IC3.4 93.73,35.56 | 93.73,35.56 92.46,36.83 IC3.10 IC3.9 | 93.73,35.56 97.28,35.56 97.54,35.31 IC3.1 97.54,30.48 97.92,30.1 v98.55,30.1 | IC1.44 48.2,78.17 50.29,76.07 v51.31,76.07 | v97.41,76.07 89.66,83.82 v82.17,83.82
SD_WP  (via drill 0.35, 0.35 pad 1)
  Top 0.508: v53.72,78.61 54.48,79.38 54.48,79.88 60.45,85.85 77.85,85.85 v80.01,88.01 | v96.9,27.05 96.9,30.35 97.66,31.11 97.66,71.37 96.01,73.02 v96.01,83.44
  Bottom 0.508: U$1.10 90.81,27.05 v96.9,27.05 | IC1.41 51,80.57 52.96,78.61 v53.72,78.61 | v80.01,88.01 91.44,88.01 v96.01,83.44
SDA
  Bottom 0.508: IC1.20 28.12,84.57 | 20.89,78.93 21.72,79.76 23.3,79.76 28.12,84.57 | 20.89,78.93 IC2.5 | R11.2 27.73,84.96 28.12,84.57 | 20.89,78.93 19.56,80.26 18.03,80.26 14.73,83.57 14.73,96.52 9.91,101.35 9.91,106.81 11.24,108.14 X3.5 15.18,108.14 15.23,108.09 12.05,108.09
  Bottom 0.813: X3.5 23.62,108.14 X6.4 X5.4
SIREN  (via drill 0.35 pad 1)
  Top 0.508: v62.99,98.04 62.99,91.44 v52.45,80.9
  Bottom 0.508: v52.45,80.9 51.98,81.37 IC1.40 | Q9.1 63.04,98 v62.99,98.04
TCH_SENSOR_1  (via drill 0.35 pad 1, 0.35 pad 1.52)
  Top 0.508: v37.34,72.39 35.43,72.39 31.5,76.33 31.5,84.07 37.47,90.04 37.47,92.71 36.32,93.85 12.45,93.85 9.65,96.65 9.65,104.14 11.68,106.17 14.48,106.17 15.11,106.81 15.11,116.84 18.03,119.76 37.08,119.76 40.89,115.95 v40.89,113.41
  Bottom 0.508: R19.2 64.77,104.02 62.99,105.79 47.37,105.79 46.1,107.06 OK2.4 45.97,110.11 42.67,113.41 v40.89,113.41 | IC1.10 38.58,75.03 37.34,73.79 v37.34,72.39
VCC  (via drill 0.35 pad 1, 0.35 pad 1.3)  (1 unrouted)
  Top 0.508: v26.16,90.8 27.69,89.28 27.69,78.99 v27.94,78.74 27.43,78.23 27.43,74.17 25.38,72.11 25.38,68.55 v23.88,67.06
  Bottom 0.508: IC1.17 32.09,82.17 C3.1 | C1.2 17.75,93.15 R10.3 | R2.1 27.31,78.11 v27.94,78.74 | IC1.38 54.7,82.97 58.17,79.5 58.17,72.64 52.32,66.8 44.83,66.8 | 44.83,66.8 24.13,66.8 v23.88,67.06 | IC4.3 92.18,43.03 | 84.33,42.55 SG1.+ | IC1.5 42.58,69.83 R16.1 42.48,69.16 44.83,66.8 | R3.1 76.58,99.31 74.68,101.22
  Bottom 0.813: R10.3 23.95,93.15 25.27,91.82 | v27.94,78.74 29.21,78.74 31.33,80.86 C3.1 | R8.2 R7.2 R6.2 R5.2 42.04,45.47 | P2.P$3 50.49,45.47 42.04,45.47 | 25.27,91.82 26.16,90.93 v26.16,90.8 25.4,90.04 R11.1 | 42.04,45.47 44.2,47.63 R9.1 47.25,53.09 56.39,53.09 68.83,65.53 68.83,72.39 70.23,73.79 72.77,73.79 75.44,71.12 | 25.27,91.82 LCD1.2 25.27,103.5 26.42,104.65 43.43,104.65 | 43.43,104.65 57.91,104.65 58.29,104.27 LCD1.15 58.17,101.35 58.17,103.12 59.56,104.52 62.23,104.52 65.53,101.22 R19.1 R18.1 74.67,101.22 | 43.43,104.65 40.26,107.82 40.26,109.86 36.83,113.28 X5.2 X6.2 21.59,113.28 19.11,115.76 X3.2 12.3,115.68 10.45,115.68 5.71,110.94 5.71,8.76 11.68,2.79 58.42,2.79 60.83,5.21 60.83,33.78 66.29,39.24 80.52,39.24 SG1.+ 84.07,57.02 82.42,58.67 82.42,68.71 80.01,71.12 75.44,71.12 | D1.A 75.44,71.12 | 92.18,43.03 91.69,42.55 84.33,42.55 | X1.2 85.47,117.22 84.58,116.33 84.58,111.12 74.67,101.22 | 74.68,101.22 74.67,101.22